# Altium project Thermometer.PrjPcb
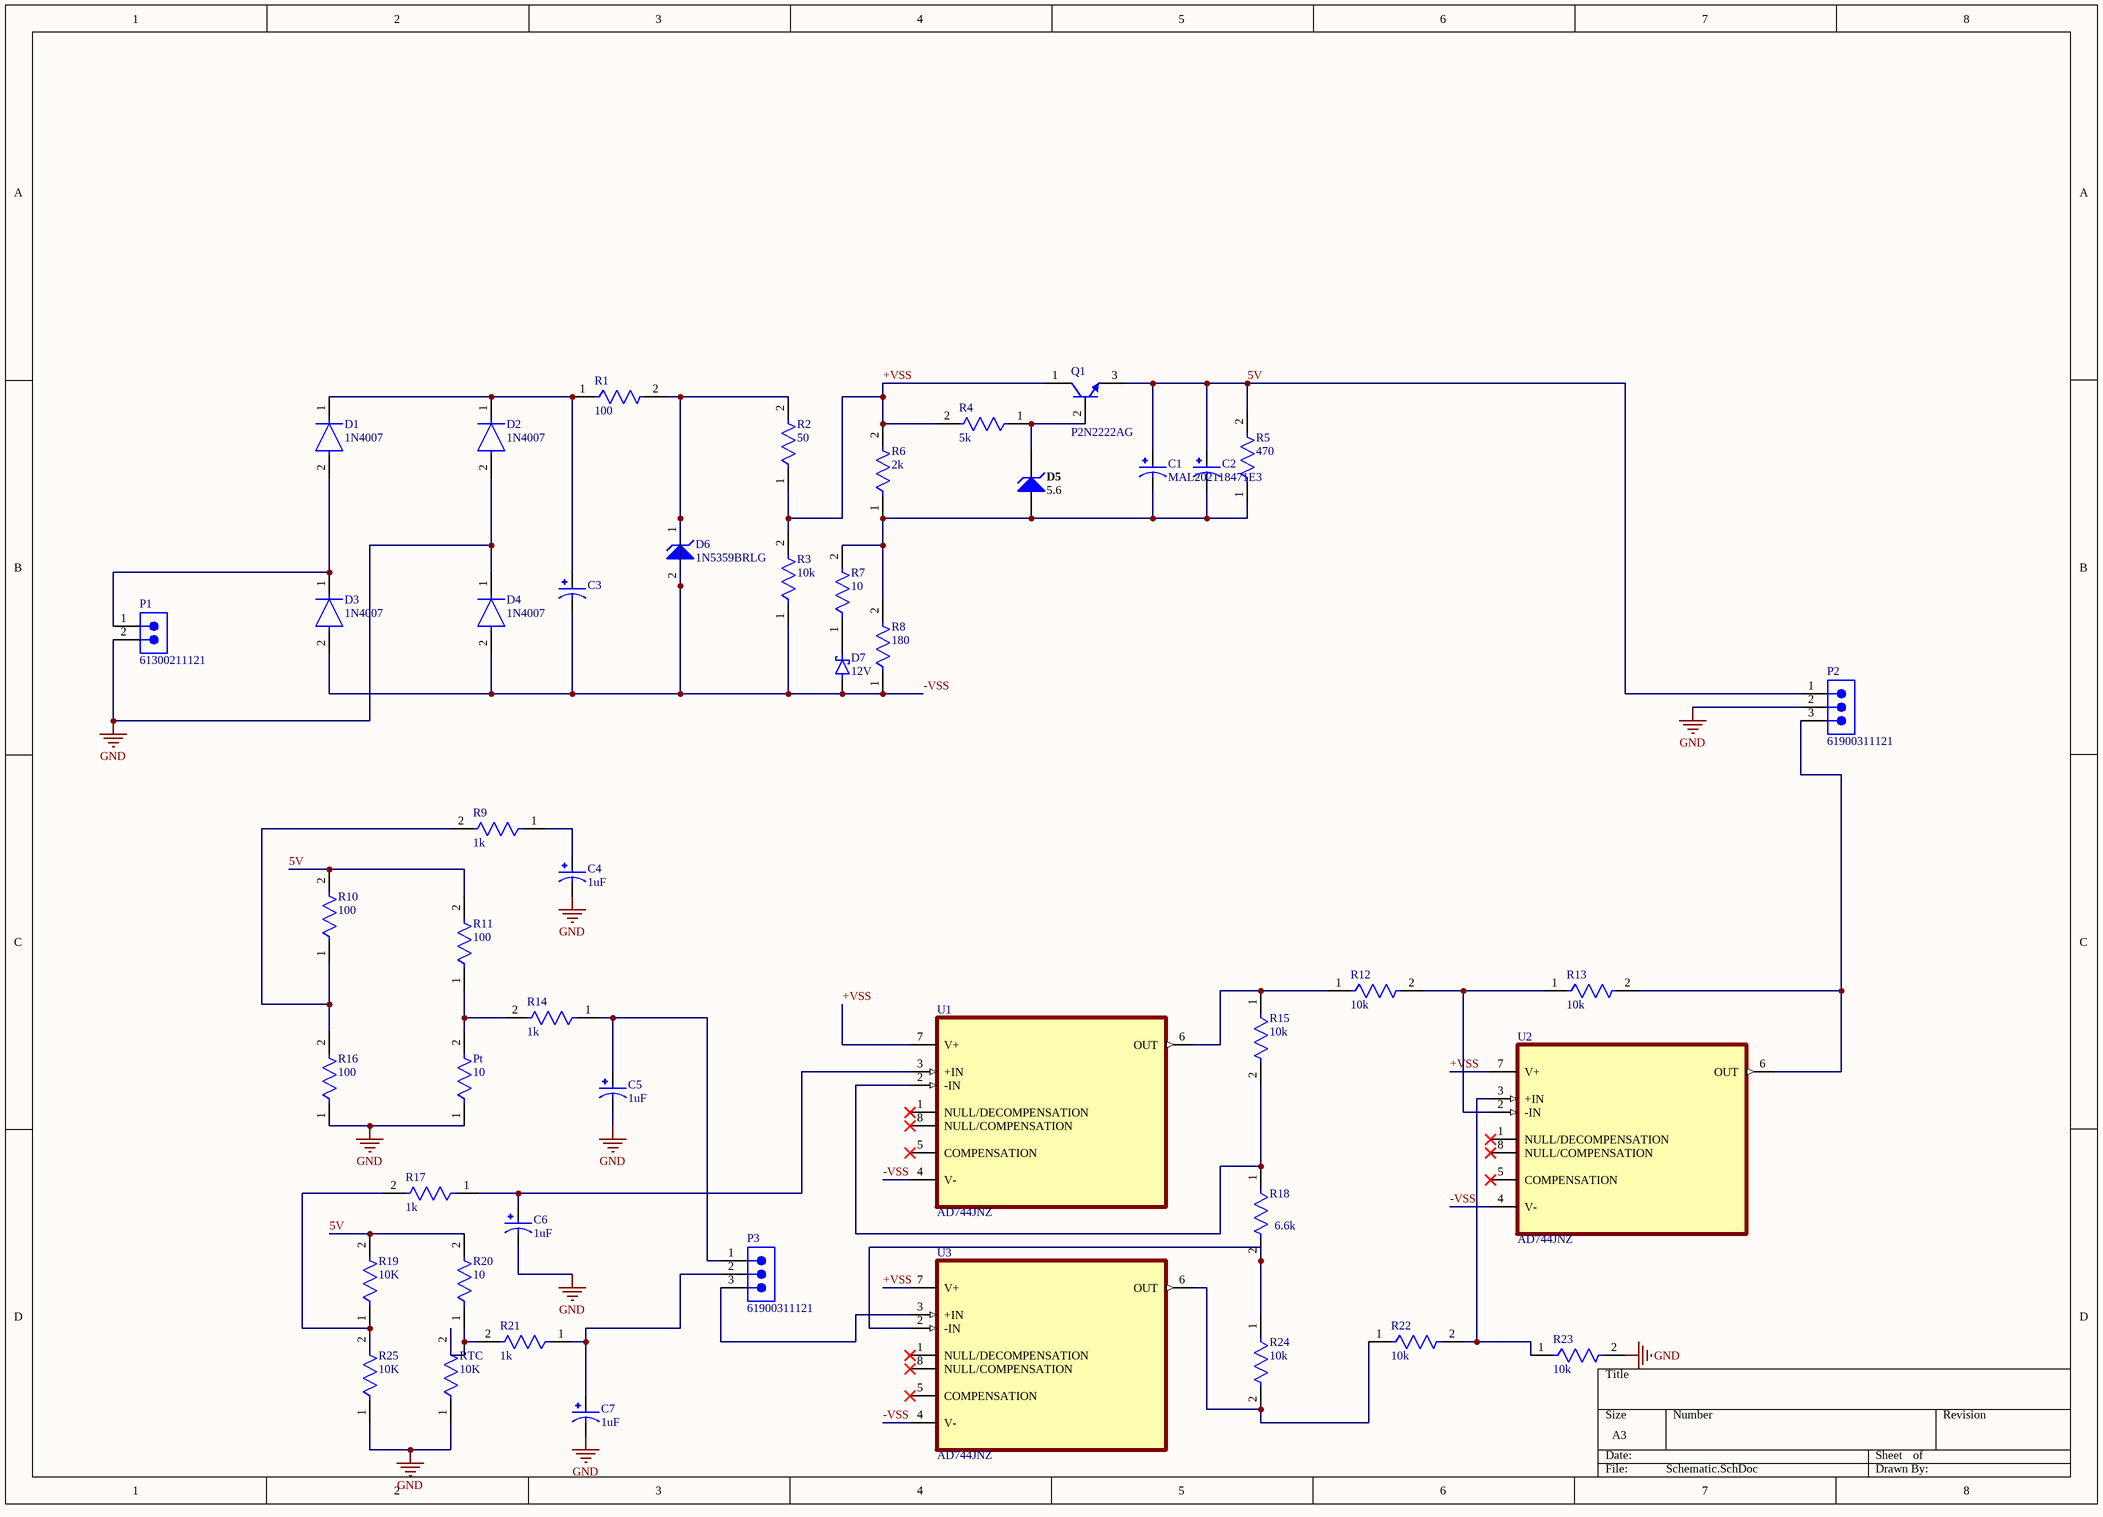
[diagram p0: Schematic.SchDoc]
1 sheet, 48 parts. Net scope: global (net labels, ports and power ports of the same name join across sheets).
Board file: PCB1.PcbDoc

## Sheet Schematic.SchDoc
size A3; SheetNumber: 1; SheetTotal: 1

### Parts
C1  MAL202118471E3  [FP-MAL202118471E3-MFG]
C2  (no value)  [FP-MAL202118471E3-MFG]
C3  (no value)  [FP-MAL202118471E3-MFG]
C4  1uF  [FP-MAL202118471E3-MFG]
C5  1uF  [FP-MAL202118471E3-MFG]
C6  1uF  [FP-MAL202118471E3-MFG]
C7  1uF  [FP-MAL202118471E3-MFG]
D1  1N4007  [FP-1N4007-MFG]
D2  1N4007  [FP-1N4007-MFG]
D3  1N4007  [FP-1N4007-MFG]
D4  1N4007  [FP-1N4007-MFG]
D5  5.6  [FAIR-DO-41-2_V]
D6  1N5359BRLG  [ONSC-SURMETIC40-2-017AA-01]
D7  12V  [DIOAD1543W101L863D368]
P1  61300211121  [61300211121]
P2  61900311121  [61900311121]
P3  61900311121  [61900311121]
Pt  10  [FP-MRS25-MFG]
Q1  P2N2222AG  [ONSC-TO-92-3-29-11]
R1  100  [FP-MRS25-MFG]
R2  50  [FP-MRS25-MFG]
R3  10k  [FP-MRS25-MFG]
R4  5k  [FP-MRS25-MFG]
R5  470  [FP-MRS25-MFG]
R6  2k  [FP-MRS25-MFG]
R7  10  [FP-MRS25-MFG]
R8  180  [FP-MRS25-MFG]
R9  1k  [FP-MRS25-MFG]
R10  100  [FP-MRS25-MFG]
R11  100  [FP-MRS25-MFG]
R12  10k  [FP-MRS25-MFG]
R13  10k  [FP-MRS25-MFG]
R14  1k  [FP-MRS25-MFG]
R15  10k  [FP-MRS25-MFG]
R16  100  [FP-MRS25-MFG]
R17  1k  [FP-MRS25-MFG]
R18  6.6k  [FP-MRS25-MFG]
R19  10K  [FP-MRS25-MFG]
R20  10  [FP-MRS25-MFG]
R21  1k  [FP-MRS25-MFG]
R22  10k  [FP-MRS25-MFG]
R23  10k  [FP-MRS25-MFG]
R24  10k  [FP-MRS25-MFG]
R25  10K  [FP-MRS25-MFG]
RTC  10K  [FP-MRS25-MFG]
U1  AD744JNZ  [DIP254P762X444-8]
U2  AD744JNZ  [DIP254P762X444-8]
U3  AD744JNZ  [DIP254P762X444-8]

### Nets
GND: C4.N C5.N C6.N C7.N D2.2(A) D4.1(C) P1.2 P2.2 Pt.1 R16.1 R23.2 R25.1 RTC.1
5V: C1.P C2.P P2.1 Q1.3(E) R5.2 R10.2 R11.2 R19.2 R20.2
+VSS: Q1.1(C) R2.1 R3.2 R4.2 R6.2 U1.7(V+) U2.7(V+) U3.7(V+)
-VSS: C3.N D3.2(A) D4.2(A) D6.1(K) D6.2(A) D7.2(A) R1.2 R2.2 R3.1 R8.1 U1.4(V-) U2.4(V-) U3.4(V-)
NetC1_N: C1.N C2.N D5.1(A) R5.1 R6.1 R7.2 R8.2
NetC3_P: C3.P D1.1(C) D2.1(C) R1.1
NetC4_P: C4.P R9.1
NetC5_P: C5.P P3.1 R14.1
NetC6_P: C6.P R17.1 U1.3(+IN)
NetC7_P: C7.P P3.2 R21.1
NetD1_2: D1.2(A) D3.1(C) P1.1
NetD5_2: D5.2(K) Q1.2(B) R4.1
NetD7_1: D7.1(K) R7.1
NetP2_3: P2.3 R13.2 U2.6(OUT)
NetP3_3: P3.3 U3.3(+IN)
NetPt_2: Pt.2 R11.1 R14.2
NetR9_2: R9.2 R10.1 R16.2
NetR12_1: R12.1 R15.1 U1.6(OUT)
NetR12_2: R12.2 R13.1 U2.2(-IN)
NetR15_2: R15.2 R18.1 U1.2(-IN)
NetR17_2: R17.2 R19.1 R25.2
NetR18_2: R18.2 R24.1 U3.2(-IN)
NetR20_1: R20.1 R21.2 RTC.2
NetR22_1: R22.1 R24.2 U3.6(OUT)
NetR22_2: R22.2 R23.1 U2.3(+IN)

Not connected (* = marked no-connect by the designer): U1 1(NULL/DECOMPENSATION)* 5(COMPENSATION)* 8(NULL/COMPENSATION)*; U2 1(NULL/DECOMPENSATION)* 5(COMPENSATION)* 8(NULL/COMPENSATION)*; U3 1(NULL/DECOMPENSATION)* 5(COMPENSATION)* 8(NULL/COMPENSATION)*

### Library data of the parts
C1-C7 = EEUFS1K471L: CAP ALUM 470UF 20% 80V RADIAL; MF: Panasonic; Value: *; Package: RADIAL-2 Panasonic; Purchase-URL: https://pricing.snapeda.com/search/part/EEUFS1K471L/?ref=eda; SnapEDA_Link: https://www.snapeda.com/parts/EEUFS1K471L/Panasonic/view-part/?ref=snap; Price: None; Check_prices: https://www.snapeda.com/parts/EEUFS1K471L/Panasonic/view-part/?ref=eda; Availability: In Stock; MP: EEUFS1K471L
D1-D4 = CMP-123542-000001-1: Rectifier diode 1000 V 1 A DO-41, ,; Manufacturer: Diotec; Max Surge Forward Current: 27A; Forward Current: 1A; Max Junction Temp: +175°C; Reverse Voltage: 1000V; Value: 15pF; Peak Reverse Current: 5uA; Category: Diode; Temperature Range Low: -50°C; Automotive: No; Temperature: -50°C to +175°C; Lead Free: Yes; ComponentLink2Description: Datasheet; Max Repetitive Reverse Voltage: 1000V; ComponentLink2URL: https://datasheet.octopart.com/1N4007-Diotec-datasheet-62346875.pdf; Manufacturer Part Number: 1N4007; Device Class L3: Rectifier Diodes; Height: 2.8mm; Octopart: https://octopart.com/1n4007-diotec-4040411; Package: 1N4007; Temperature Range High: +175°C; Device Class L1: Discrete Semiconductors; Device Class L2: Diodes; RoHS: TRUE; Capacitance: 15pF; Ipc Land Pattern Name: DIOAD888W100L520D280
D5 = CMP-0892-00009-1: Zener Diode, 5.6V, 1W, 5%, -65 to 200 degC, 2-Pin DO-41, Body 2.72 x 5.2 mm, RoHS; Manufacturer: Fairchild Semiconductor; PartNumber: 1N4734A; VZ (Min.) (V): 5.32; IR (uA): 10; ZZ (Max) (ohm): 5; VZ (Max.) (V): 5.88; PD (W): 1; Test Current IZ (mA): 45; Mounting Technology: Through Hole; DatasheetVersion: Rev. H3; ComponentLink1Description: Manufacturer URL; ComponentLink2URL: http://www.fairchildsemi.com/ds/1N/1N4744A.pdf; ComponentLink3Description: Package Specification; Tolerance: 5%; RoHS: TRUE; ComponentLink2Description: Datasheet; PackageDescription: 2-Pin Axial leaded, Body 2.72 x 5.2 mm, Lead Spread 25.4 mm; Operating and Storage Temperature Range: -65 to 200 degC; PackageReference: DO-41-2; PackageVersion: Rev. 2; ComponentLink1URL: http://www.fairchildsemi.com/; ComponentLink3URL: http://www.fairchildsemi.com/dwg/DO/DO41A.pdf
D6 = CMP-1060-01318-1: 5 W Zener Voltage Regulator, 2-Pin Surmetic(TM) 40, Pb-Free, Tape and Reel; Manufacturer: On Semiconductor; VZ Typ (V): 24; P Max (W): 5; PackageDescription: 2-Pin, Axial Lead, Diameter 3.49 mm; PackageReference: SURMETIC40-2-017AA-01; DatasheetVersion: Rev. 14; ComponentLink2Description: Datasheet; ComponentLink1URL: http://www.onsemi.com/; ComponentLink3Description: Package Specification; ComponentLink3URL: http://www.onsemi.cn/pub_link/Collateral/017AA.PDF; Packing: Tape and Reel; ComponentLink2URL: http://www.onsemi.cn/pub_link/Collateral/1N5333B-D.PDF; RoHS: Pb-Free; PackageVersion: Rev. O, 09/2005; PartNumber: 1N5359BRLG; Mounting Technology: Through Hole; ComponentLink1Description: Manufacturer URL
D7 = 1N5349BRL: Zener Diode Single 12V 5% 2.5Ohm 5000mW 2-Pin Case 017AA-01 T/R; MF: ON Semiconductor; SnapEDA_Link: https://www.snapeda.com/parts/1N5349BRL/Onsemi/view-part/?ref=snap; Package: None; Value: *; MP: 1N5349BRL; Check_prices: https://www.snapeda.com/parts/1N5349BRL/Onsemi/view-part/?ref=eda
P1 = CMP-1712-00002-6: NexarPartId: 20081794; Number of Contacts: 2; Pitch: 2.54mm; Connector Type: Male Pin; Voltage Rating: 250V; Current Rating: 3A; Gender: Male; Contact Resistance: 20mΩ; Height: 8.94mm; Lead Free: Lead Free; Number of Pins: 2; Termination: Through Hole; RoHS: Compliant; Lead Pitch: 2.54mm; REACH SVHC: No SVHC; Housing Material: PBT; Contact Mating Length: 5.9944mm; Min Operating Temperature: -40°C; Orientation: Vertical; Contact Material: Copper; Contact Gender: Male; Max Operating Temperature: 125°C; Number of Rows: 1; Number of Positions: 2; Packaging: Bulk; Contact Plating: Gold; Mount: Through Hole; Color: Black; Operating Supply Voltage: 250V
P2 P3 = CMP-1502-00585-2: NexarPartId: 18818222; Current Rating: 3A; Voltage Rating: 250V; Number of Positions: 3; Insulation Resistance: 1GΩ; Gender: Male; Pitch: 2.54mm; Connector Type: Male Pin; Contact Resistance: 20mΩ; Termination: Through Hole; Width: 7.66mm; Contact Plating: Tin; Orientation: Vertical; Mount: Through Hole; Contact Gender: Male; Max Operating Temperature: 105°C; Length: 7.62mm; Number of Rows: 1; Height: 12.5mm; Lead Pitch: 2.54mm; Housing Material: Nylon; Color: Beige; Contact Material: Copper; Fastening Type: Friction; Min Operating Temperature: -40°C; Number of Contacts: 3; Number of Pins: 3; Flammability Rating: UL94 V-0; Contact Mating Length: 7.493mm; RoHS: Compliant; REACH SVHC: Unknown; Packaging: Bulk; Operating Supply Voltage: 250V
Pt R1-R25 RTC = CMP-00030-42757237-1: MRS25000C1000FRP00 Resistor, 100 Ohm, ± 1%, 600 mW, Axial Leaded, Metal Film (Thin Film), Professional; Max Power Dissipation: 600mW; Resistance: 100Ω; Voltage Rating: 350V; Temperature Coefficient: 50ppm/°C; Lead Diameter: 600µm; RoHS: Compliant; Radiation Hardening: No; Schedule B: 8533210090, 8533210090; Length: 6.5mm; Packaging: Tape & Reel (TR); Number of Terminations: 2; Mount: Through Hole; Width: 2.5mm; Tolerance: 1%; Military Standard: Not; Voltage Rating (DC): 350V; Contact Plating: Tin; Number of Pins: 2; Max Operating Temperature: 155°C; NexarPartId: 42757237; Diameter: 2.5mm; Composition: Metal Film, Thin Film; REACH SVHC: Unknown; Power Rating: 600mW; Lead Free: Lead Free; Termination: Axial; Case/Package: Axial; Min Operating Temperature: -55°C
Q1 = CMP-1048-01402-1: Amplifier Transistor, NPN Silicon, 3-Pin TO-92, Pb-Free, Bulk Box; Manufacturer: On Semiconductor; IC Continuous (A): 0.6; fT Min (MHz): 300; ComponentLink2Description: Datasheet; ComponentLink1Description: Manufacturer URL; ComponentLink2URL: http://www.onsemi.com/pub_link/Collateral/P2N2222A-D.PDF; ComponentLink3Description: Package Specification; RoHS: TRUE; ComponentLink1URL: http://www.onsemi.com/; PartNumber: P2N2222AG; Mounting Technology: Through Hole; PackageReference: TO-92-3-29-11_AM_SL; Polarity: NPN; Packing: Bulk Box; DatasheetVersion: Rev. 7; PackageDescription: 3-Pin Transistor Outline, Body 4.825 x 3.685 mm, Pitch 1.27 mm; PackageVersion: Rev. AM; ComponentLink3URL: http://www.onsemi.cn/pub_link/Collateral/2N6426-D.PDF
U1-U3 = AD744JNZ: Precision, 500 ns Settling BiFET Op Amp; MF: Analog Devices; SnapEDA_Link: https://www.snapeda.com/parts/AD744JNZ/Analog+Devices/view-part/?ref=snap; Package: PDIP-8 Analog Devices; Value: *; MP: AD744JNZ; Check_prices: https://www.snapeda.com/parts/AD744JNZ/Analog+Devices/view-part/?ref=eda